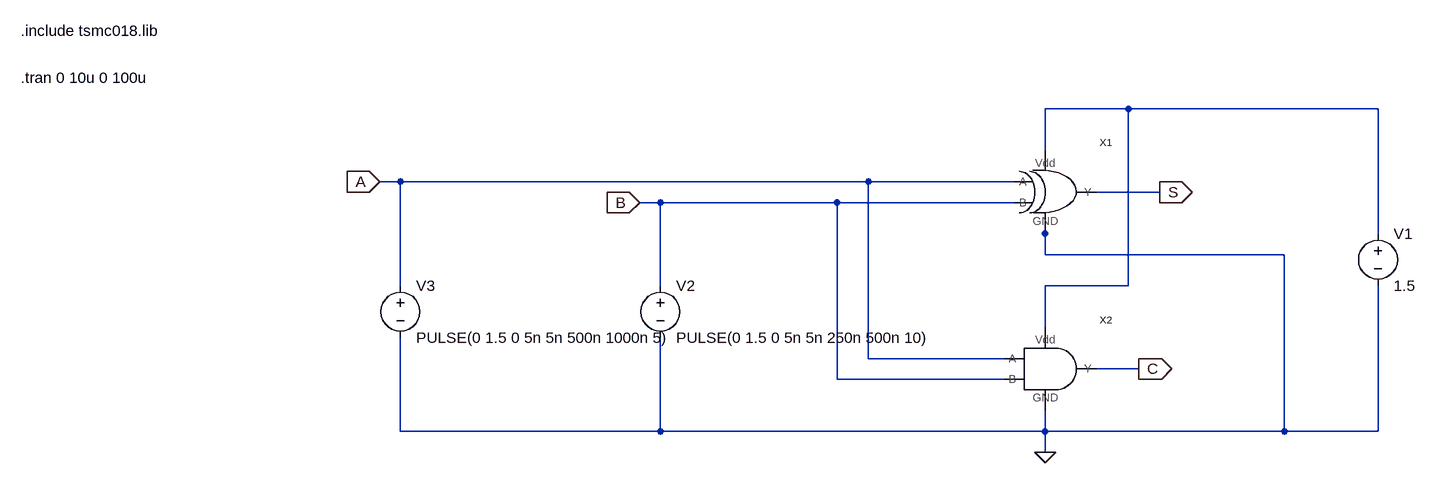
[diagram p0: schematic half_adder_cmos.asc]
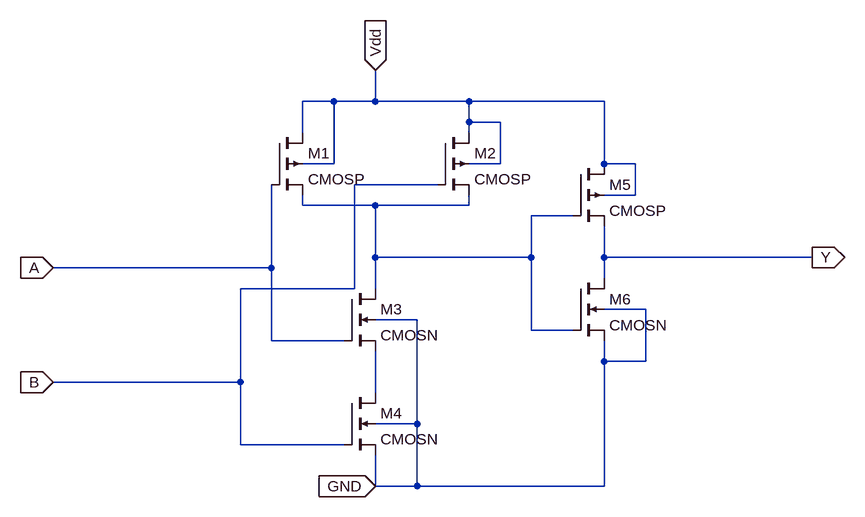
[diagram p1: sub-circuit and_cmos.asc]
half_adder_cmos.asc, the LTspice schematic file:
Version 4
SHEET 1 880 680
WIRE 352 0 224 0
WIRE 736 0 352 0
WIRE 224 64 224 0
WIRE -768 112 -800 112
WIRE -48 112 -768 112
WIRE 176 112 -48 112
WIRE 400 128 304 128
WIRE -368 144 -400 144
WIRE -96 144 -368 144
WIRE 176 144 -96 144
WIRE 224 192 224 176
WIRE 736 192 736 0
WIRE 224 224 224 192
WIRE 592 224 224 224
WIRE -768 272 -768 112
WIRE -368 272 -368 144
WIRE 352 272 352 0
WIRE 352 272 224 272
WIRE 224 336 224 272
WIRE -48 384 -48 112
WIRE 160 384 -48 384
WIRE 368 400 304 400
WIRE -96 416 -96 144
WIRE 160 416 -96 416
WIRE -768 496 -768 352
WIRE -368 496 -368 352
WIRE -368 496 -768 496
WIRE 224 496 224 464
WIRE 224 496 -368 496
WIRE 592 496 592 224
WIRE 592 496 224 496
WIRE 736 496 736 272
WIRE 736 496 592 496
WIRE 224 528 224 496
FLAG -800 112 A
IOPIN -800 112 In
FLAG -400 144 B
IOPIN -400 144 In
FLAG 400 128 S
IOPIN 400 128 Out
FLAG 368 400 C
IOPIN 368 400 Out
FLAG 224 528 0
SYMBOL xor_cmos 192 96 R0
SYMATTR InstName X1
SYMBOL and_cmos 192 368 R0
SYMATTR InstName X2
SYMBOL voltage 736 176 R0
WINDOW 123 0 0 Left 0
WINDOW 39 0 0 Left 0
SYMATTR InstName V1
SYMATTR Value 1.5
SYMBOL voltage -368 256 R0
WINDOW 123 0 0 Left 0
WINDOW 39 0 0 Left 0
SYMATTR InstName V2
SYMATTR Value PULSE(0 1.5 0 5n 5n 250n 500n 10)
SYMBOL voltage -768 256 R0
WINDOW 123 0 0 Left 0
WINDOW 39 0 0 Left 0
SYMATTR InstName V3
SYMATTR Value PULSE(0 1.5 0 5n 5n 500n 1000n 5)
TEXT -1352 -120 Left 2 !.include tsmc018.lib
TEXT -1352 -48 Left 2 !.tran 0 10u 0 100u

and_cmos.asc, the sub-circuit schematic file:
Version 4
SHEET 1 1020 696
WIRE 208 32 160 32
WIRE 272 32 272 -16
WIRE 272 32 208 32
WIRE 416 32 272 32
WIRE 624 32 416 32
WIRE 416 64 416 32
WIRE 464 64 416 64
WIRE 160 80 160 32
WIRE 416 80 416 64
WIRE 208 128 208 32
WIRE 208 128 160 128
WIRE 464 128 464 64
WIRE 464 128 416 128
WIRE 624 128 624 32
WIRE 672 128 624 128
WIRE 368 160 240 160
WIRE 672 176 672 128
WIRE 672 176 624 176
WIRE 160 192 160 176
WIRE 272 192 160 192
WIRE 416 192 416 176
WIRE 416 192 272 192
WIRE 576 208 512 208
WIRE 272 272 272 192
WIRE 512 272 512 208
WIRE 512 272 272 272
WIRE 624 272 624 224
WIRE 944 272 624 272
WIRE 112 288 112 160
WIRE 112 288 -224 288
WIRE 624 304 624 272
WIRE 240 320 240 160
WIRE 240 320 64 320
WIRE 272 320 272 272
WIRE 688 352 624 352
WIRE 336 368 272 368
WIRE 512 384 512 272
WIRE 576 384 512 384
WIRE 112 400 112 288
WIRE 224 400 112 400
WIRE 624 432 624 400
WIRE 688 432 688 352
WIRE 688 432 624 432
WIRE 64 464 64 320
WIRE 64 464 -224 464
WIRE 272 480 272 416
WIRE 336 528 336 368
WIRE 336 528 272 528
WIRE 64 560 64 464
WIRE 224 560 64 560
WIRE 272 624 272 576
WIRE 336 624 336 528
WIRE 336 624 272 624
WIRE 624 624 624 432
WIRE 624 624 336 624
FLAG 272 -16 Vdd
IOPIN 272 -16 In
FLAG 272 624 GND
IOPIN 272 624 In
FLAG -224 288 A
IOPIN -224 288 In
FLAG -224 464 B
IOPIN -224 464 In
FLAG 944 272 Y
IOPIN 944 272 Out
SYMBOL cmosp 112 80 R0
SYMATTR InstName M1
SYMATTR Value2 l=180n w=1u
SYMBOL cmosp 368 80 R0
SYMATTR InstName M2
SYMATTR Value2 l=180n w=1u
SYMBOL cmosn 224 320 R0
SYMATTR InstName M3
SYMATTR Value2 l=180n w=1u
SYMBOL cmosn 224 480 R0
SYMATTR InstName M4
SYMATTR Value2 l=180n w=1u
SYMBOL cmosp 576 128 R0
SYMATTR InstName M5
SYMBOL cmosn 576 304 R0
SYMATTR InstName M6

The netlist it stands for:
* half_adder_cmos.asc
XX1 S N001 0 A B xor_cmos  ; pins Y Vdd GND A B
XX2 C N001 0 A B and_cmos
V1 N001 0 1.5
V2 B 0 PULSE(0 1.5 0 5n 5n 250n 500n 10)
V3 A 0 PULSE(0 1.5 0 5n 5n 500n 1000n 5)

* block symbol definitions
.subckt and_cmos Y Vdd GND A B
M1 Vdd A N001 Vdd CMOSP l=180n w=1u
M2 Vdd B N001 Vdd CMOSP l=180n w=1u
M3 N001 A N002 GND CMOSN l=180n w=1u
M4 N002 B GND GND CMOSN l=180n w=1u
M5 Vdd N001 Y Vdd CMOSP
M6 Y N001 GND GND CMOSN
.ends and_cmos

.model NMOS NMOS
.model PMOS PMOS
.lib standard.mos
.include tsmc018.lib
.tran 0 10u 0 100u
.backanno
.end